# Altium schematic sheet MCU.SchDoc
size A4; SheetNumber: 2; SheetTotal: 5
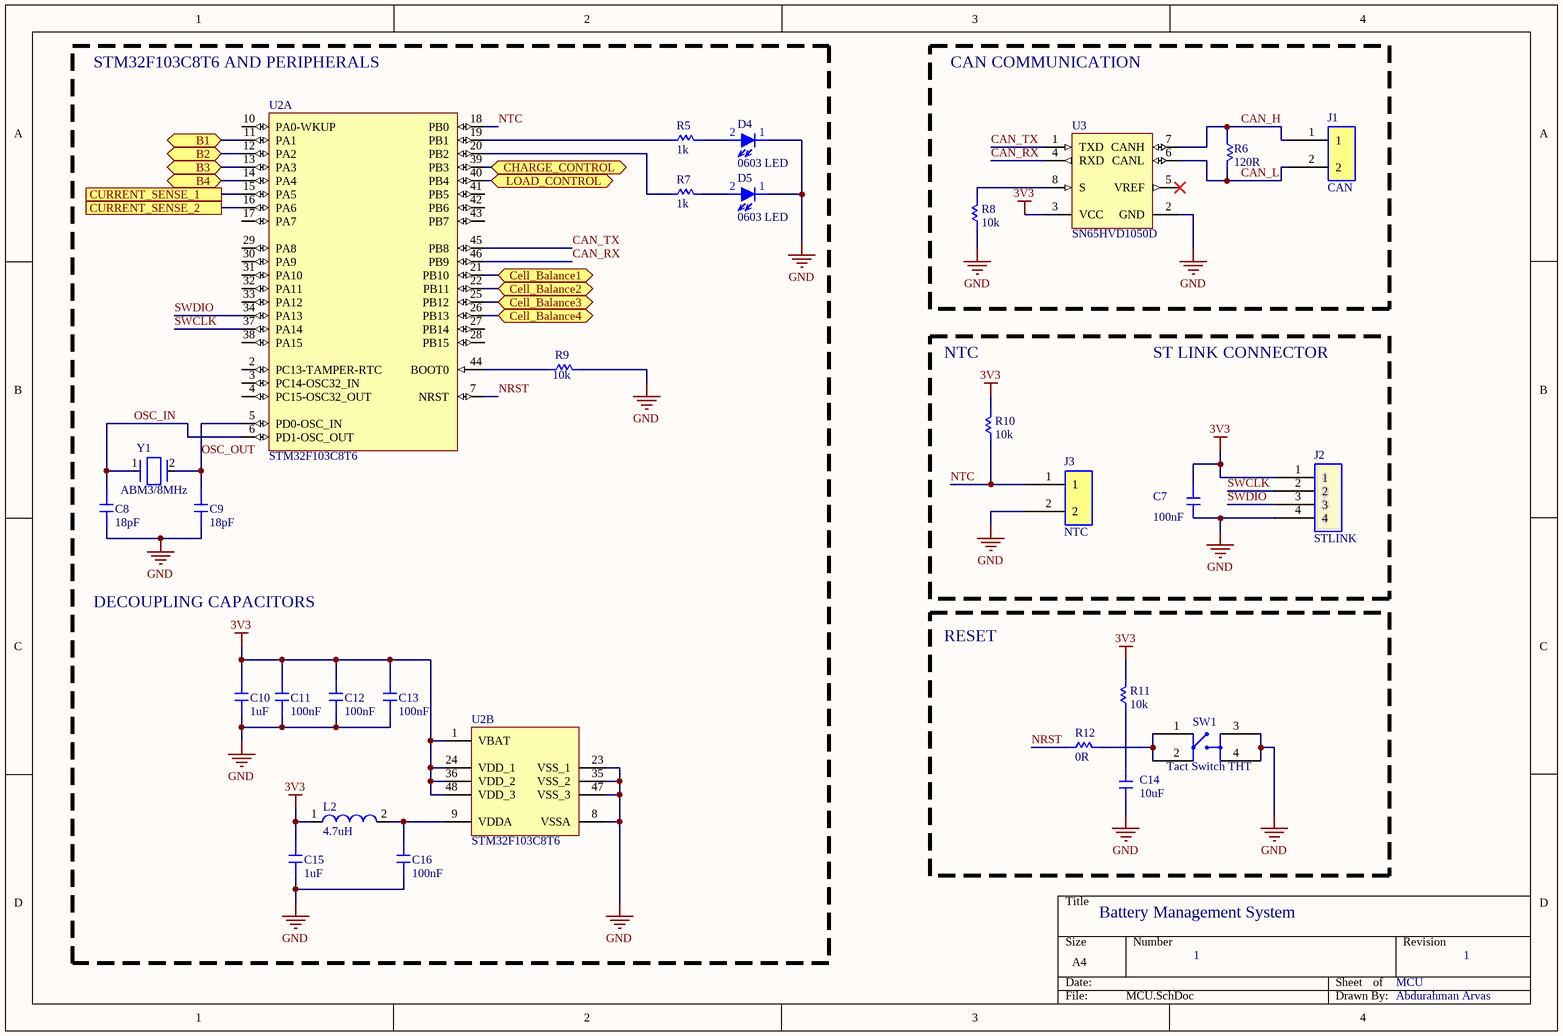
[diagram p0: MCU.SchDoc]

## Parts
C7  100nF  [C0805]
C8  18pF  [C0603]
C9  18pF  [C0603]
C10  1uF  [C0805]
C11  100nF  [C0805]
C12  100nF  [C0805]
C13  100nF  [C0805]
C14  10uF  [C0805]
C15  1uF  [C0805]
C16  100nF  [C0805]
D4  0603 LED  [LED_0603]
D5  0603 LED  [LED_0603]
J1  CAN  [CONN X2]
J2  STLINK  [CONN X4]
J3  NTC  [CONN X2]
L2  4.7uH  [SMD-0805]
R5  1k  [R0603]
R6  120R  [R0805]
R7  1k  [R0603]
R8  10k  [R0805]
R9  10k  [R0805]
R10  10k  [R0805]
R11  10k  [R0805]
R12  0R  [R0805]
SW1  Tact Switch THT  [Tact Switch 6x6 mm]
U2  STM32F103C8T6  [STM-LQFP48_L]  (parts A,B of 2)
U3  SN65HVD1050D  [D0008A_N]
Y1  ABM3/8MHz  [FP-ABM3-MFG]

## Blocks framed on the sheet
CAN COMMUNICATION: J1 R6 R8 U3
RESET: C14 R11 R12 SW1

## Ports
B1 (bidir), B2 (bidir), B3 (bidir), B4 (bidir), Cell_Balance1 (bidir), Cell_Balance2 (bidir), Cell_Balance3 (bidir), Cell_Balance4 (bidir), CHARGE_CONTROL (bidir), CURRENT_SENSE_1, CURRENT_SENSE_2, LOAD_CONTROL (bidir)

## Nets
3V3: C7.2 C10.2 C11.2 C12.2 C13.2 C15.2 J2.1 L2.1 R10.2 R11.2 U2.1(VBAT) U2.24(VDD_1) U2.36(VDD_2) U2.48(VDD_3) U3.3(VCC)
GND: C7.1 C8.1 C9.1 C10.1 C11.1 C12.1 C13.1 C14.1 C15.1 C16.1 D4.1(Cathode) D5.1(Cathode) J2.4 J3.2 R8.1 R9.2 SW1.3 SW1.4 U2.8(VSSA) U2.23(VSS_1) U2.35(VSS_2) U2.47(VSS_3) U3.2(GND)
B1: U2.11(PA1) ; port B1
B2: U2.12(PA2) ; port B2
B3: U2.13(PA3) ; port B3
B4: U2.14(PA4) ; port B4
CAN_H: J1.1 R6.1 U3.7(CANH)
CAN_L: J1.2 R6.2 U3.6(CANL)
CAN_RX: U2.46(PB9) U3.4(RXD)
CAN_TX: U2.45(PB8) U3.1(TXD)
Cell_Balance1: U2.21(PB10) ; port Cell_Balance1
Cell_Balance2: U2.22(PB11) ; port Cell_Balance2
Cell_Balance3: U2.25(PB12) ; port Cell_Balance3
Cell_Balance4: U2.26(PB13) ; port Cell_Balance4
CHARGE_CONTROL: U2.39(PB3) ; port CHARGE_CONTROL
CURRENT_SENSE_1: U2.15(PA5) ; port CURRENT_SENSE_1
CURRENT_SENSE_2: U2.16(PA6) ; port CURRENT_SENSE_2
LOAD_CONTROL: U2.40(PB4) ; port LOAD_CONTROL
NRST: R12.1 U2.7(NRST)
NTC: J3.1 R10.1 U2.18(PB0)
OSC_IN: C8.2 U2.6(PD1-OSC_OUT) Y1.1
OSC_OUT: C9.2 U2.5(PD0-OSC_IN) Y1.2
SWCLK: J2.2 U2.37(PA14)
SWDIO: J2.3 U2.34(PA13)
NetC14_2: C14.2 R11.1
NetC16_2: C16.2 L2.2 U2.9(VDDA)
NetD4_2: D4.2(Anode) R5.2
NetD5_2: D5.2(Anode) R7.2
NetR5_1: R5.1 U2.19(PB1)
NetR7_1: R7.1 U2.20(PB2)
NetR8_2: R8.2 U3.8(S)
NetR9_1: R9.1 U2.44(BOOT0)
NetR12_2: R12.2 SW1.1 SW1.2

Not connected (* = marked no-connect by the designer): U2 2(PC13-TAMPER-RTC) 3(PC14-OSC32_IN) 4(PC15-OSC32_OUT) 10(PA0-WKUP) 17(PA7) 27(PB14) 28(PB15) 29(PA8) 30(PA9) 31(PA10) 32(PA11) 33(PA12) 38(PA15) 41(PB5) 42(PB6) 43(PB7); U3 5(VREF)*

## Notes on the sheet
- STM32F103C8T6 AND PERIPHERALS
- NTC
- ST LINK CONNECTOR
- DECOUPLING CAPACITORS
- Battery Management System
- 1
- MCU
- Abdurahman Arvas

## Library data of the parts
C7-C16 = SMD_Capacitor
D4 D5 = Led 0603: Light Emitting Diode with 0603 footprint.
J1 J3 = CONN X2_1: İki Pin Connector
J2 = CONN X4: x4 Pin Header
L2 = CMP-0221-00012-1: SMD-Multilayer Inductor WE-MI, L = 1.00 µH; Inductance: 1.00 ÂµH; ComponentLink2URL: http://www.we-online.de/katalog/media/pdf/7447905.pdf; ComponentLink1Description: Manufacturer Link; ComponentLink2Description: Datasheet; DatasheetVersion: ver 4, Oct-2004; PackageVersion: 2005; PackageReference: SMD-0805; ComponentLink1URL: http://www.we-online.com; PackageDescription: Chip Inductor, 2-Leads, Body 2.0 x 1.2 mm
R5-R12 = SMD Resistor: SMD Chip Resistor
SW1 = Tact Switch THT: Tact Switch 6x6 mm
U2 = CMP-0237-00215-3: ARM Cortex-M3 32-bit MCU, 64 KB Flash, 20 KB Internal RAM, 37 I/Os, 48-pin LQFP, -40 to 85 degC, Tray; Supply Voltage(Vcc) min (V): 2; Internal RAM Size (kB): 20; FLASH Size (Prog) (kB): 64; A/D Converter: 2x12-bit (10 Channel); I/Os (High Current): 37; Operating Frequency(F) (Processor speed) (MHz): 72; Core: ARM Cortex-M3; ComponentLink3Description: Package Specification; Mounting Technology: Surface Mount; PartNumber: STM32F103C8T6; PackageReference: LQFP48; Packing: Tray; ComponentLink3URL: http://www.st.com/st-web-ui/static/active/en/resource/technical/document/datasheet/DM00058181.pdf; DatasheetVersion: Rev. 16; ComponentLink1URL: http://www.st.com/web/en/home.html; PackageVersion: Rev. 6, 06/2013; ComponentLink2URL: http://www.st.com/st-web-ui/static/active/en/resource/technical/document/datasheet/CD00161566.pdf; ComponentLink1Description: Manufacturer URL; ComponentLink2Description: Datasheet; PackageDescription: 48-Pin Low Profile Quad Flat Package, 7 x 7 mm Body, 0.5 mm Pitch
U3 = CMP-0315-00048-2: High-Speed EMC Optimized CAN Transceiver, 70 mA, 5 V, -40 to 125 degC, 8-pin SOIC (D), Green (RoHS & no Sb/Br); Manufacturer: Texas Instruments; Bus Fault Voltage(V): -4 to 16; Rating: Catalog; Drivers Per Package: 1; Transient Pulse Protection(V): -200 to 200; ICC(Max)(mA): 70; Supply Voltage(s)(V): 5; PackageVersion: revM, Jun-2011; PartNumber: SN65HVD1050D; PackageReference: D0008A; Code_JEDEC: MS-012AA; Isolated: No; ComponentLink1Description: Datasheet; PackageDescription: 8-Pin Plastic Small Outline Integrated Circuit, 4.9 x 3.9 mm, Pitch 1.27 mm Pitch; Receivers Per Package: 1; Footprint: TJA1050; DatasheetVersion: SLLS632B; SubFamily: CAN; ComponentLink1URL: http://www.ti.com/general/docs/lit/getliterature.tsp?genericPartNumber=SN65HVD1050&fileType=pdf; Eco-Plan: Green (RoHS & no Sb/Br); Mounting Technology: Surface Mount
Y1 = CMP-2000-05033-2: Crystal 8MHz ±20ppm 18pF SMD-2 5mm x 3.2mm; Series Resistance: 500R; Frequency Stability: 30ppm; ESR (Equivalent Series Resistance): 140R; Load Capacitance: 18pF; Height: 0.051inch; Tolerance: 20ppm; Depth: 3.2mm; Max Operating Temperature: 85°C; Frequency: 8MHz; Termination: SMD/SMT; Lead Free: Lead Free; Number of Pins: 2; Width: 3.2mm; RoHS Compliant: Yes; Resistor Type: Ceramic; Length: 5mm; Mount: Surface Mount; Case/Package: CSMD; Package Quantity: 1000; Radiation Hardening: No; Min Operating Temperature: -40°C; Packaging: Tape and Reel; Frequency Tolerance: 20ppm